# EAGLE design MicroPomodoro (EAGLE 8.6.0)
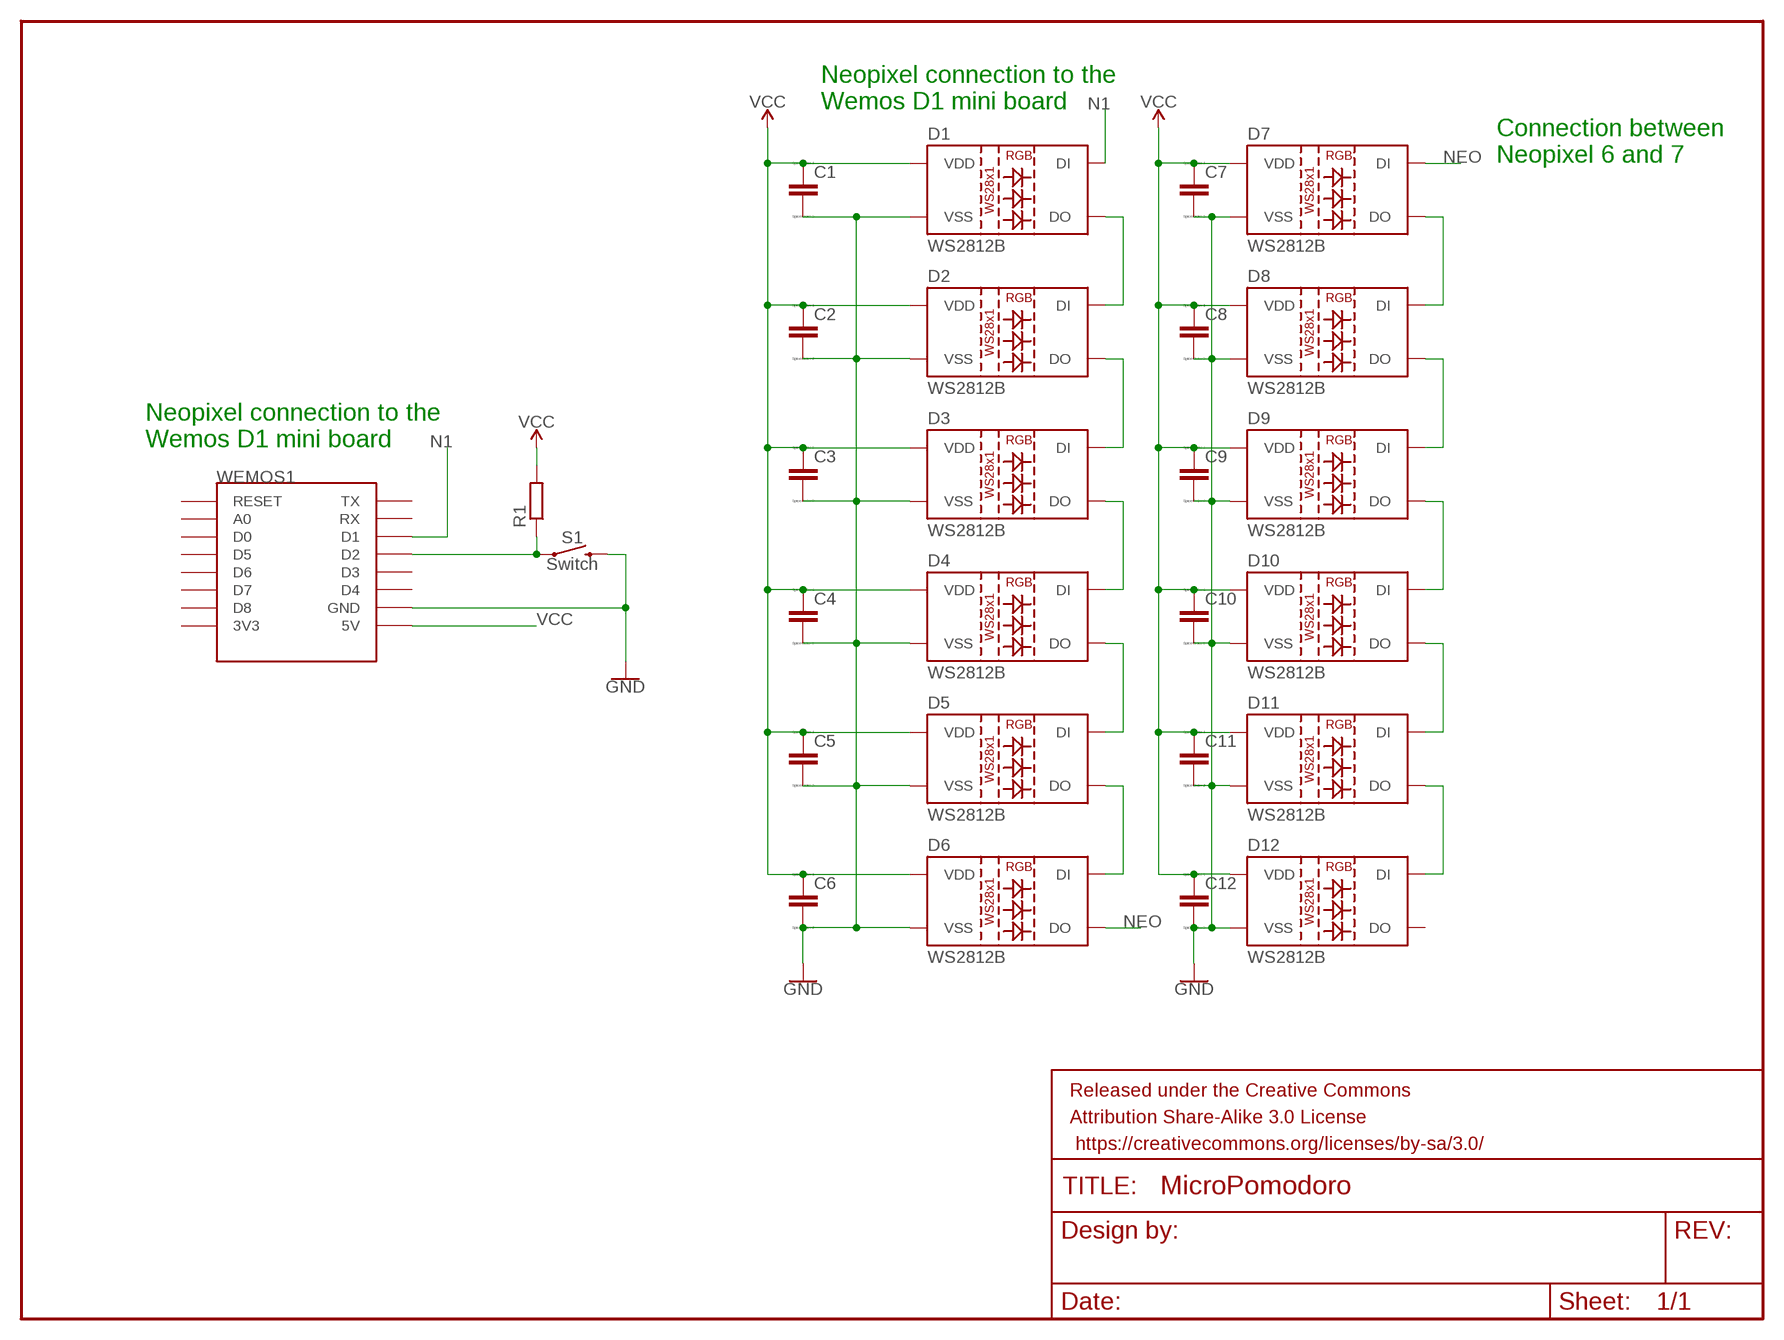
[diagram p0: schematic, sheet 1]

## Parts
C1  CC1206  [C1206]
C2  CC1206  [C1206]
C3  CC1206  [C1206]
C4  CC1206  [C1206]
C5  CC1206  [C1206]
C6  CC1206  [C1206]
C7  CC1206  [C1206]
C8  CC1206  [C1206]
C9  CC1206  [C1206]
C10  CC1206  [C1206]
C11  CC1206  [C1206]
C12  CC1206  [C1206]
D1  WS2812B  [WS2812B]
D2  WS2812B  [WS2812B]
D3  WS2812B  [WS2812B]
D4  WS2812B  [WS2812B]
D5  WS2812B  [WS2812B]
D6  WS2812B  [WS2812B]
D7  WS2812B  [WS2812B]
D8  WS2812B  [WS2812B]
D9  WS2812B  [WS2812B]
D10  WS2812B  [WS2812B]
D11  WS2812B  [WS2812B]
D12  WS2812B  [WS2812B]
FRAME1  FRAME-LETTER  [CREATIVE_COMMONS]
R1  R-EU_R1206  [R1206]
S1  Switch  MOMENTARY-SWITCH-SPST-PTH-6.0MM  [TACTILE_SWITCH_PTH_6.0MM]
WEMOS1  WEMOS-D1-MINI  [WEMOS-D1-MINI]

## Nets
GND: C1.2 C2.2 C3.2 C4.2 C5.2 C6.2 C7.2 C8.2 C9.2 C10.2 C11.2 C12.2 D1.3(VSS) D2.3(VSS) D3.3(VSS) D4.3(VSS) D5.3(VSS) D6.3(VSS) D7.3(VSS) D8.3(VSS) D9.3(VSS) D10.3(VSS) D11.3(VSS) D12.3(VSS) S1.3 WEMOS1.GND
N1: D1.4(DI) WEMOS1.D1
N$1: R1.1 S1.1 WEMOS1.D2
N$25: D1.2(DO) D2.4(DI)
N$26: D2.2(DO) D3.4(DI)
N$27: D3.2(DO) D4.4(DI)
N$28: D4.2(DO) D5.4(DI)
N$29: D5.2(DO) D6.4(DI)
N$30: D7.2(DO) D8.4(DI)
N$31: D8.2(DO) D9.4(DI)
N$32: D9.2(DO) D10.4(DI)
N$33: D10.2(DO) D11.4(DI)
N$34: D11.2(DO) D12.4(DI)
NEO: D6.2(DO) D7.4(DI)
VCC: C1.1 C2.1 C3.1 C4.1 C5.1 C6.1 C7.1 C8.1 C9.1 C10.1 C11.1 C12.1 D1.1(VDD) D2.1(VDD) D3.1(VDD) D4.1(VDD) D5.1(VDD) D6.1(VDD) D7.1(VDD) D8.1(VDD) D9.1(VDD) D10.1(VDD) D11.1(VDD) D12.1(VDD) R1.2 WEMOS1.5V
Unconnected: D12.2(DO) WEMOS1.3V3 WEMOS1.A0 WEMOS1.D0 WEMOS1.D3 WEMOS1.D4 WEMOS1.D5 WEMOS1.D6 WEMOS1.D7 WEMOS1.D8 WEMOS1.RESET WEMOS1.RX WEMOS1.TX

## Notes on the sheet
- Neopixel connection to the 
  Wemos D1 mini board
- Connection between 
  Neopixel 6 and 7
- Neopixel connection to the 
  Wemos D1 mini board

## Library data of the parts
C1-C12 = eagle-ltspice:C: CAPACITOR, European symbol; SPICEMODEL: NONE; SPICEPREFIX: C
D1-D12 = SparkFun-LED:WS2812B: WS2812B SMD addressable RGB LED 5x5mm SMD LED with built-in controller IC. Color: Red/Green/Blue mC Rating: RGB: 390, 660, 180 mcd Forward Voltage: RGB: 2.0, 3.0, 3.0 V Packages:WS2812B SparkFun Products: Blynk Board - ESP8266 <https://www.sparkfun.com/products/13794>; PROD_ID: DIO-12503
FRAME1 = SparkFun-Retired:FRAME-LETTER: Schematic Frame Standard 8.5x11 US Letter frame
R1 = resistor:R-EU_: RESISTOR, European symbol
S1 = SparkFun-Switches:MOMENTARY-SWITCH-SPST: Momentary Switch (Pushbutton) - SPST Normally-open (NO) SPST momentary switches (buttons, pushbuttons). Variants PTH-12MM - 12mm square, through-hole Momentary Pushbutton Switch - 12mm Square <https://www.sparkfun.com/products/9190> (COM-09190) PTH-6.0MM, PTH-6.0MM-KIT - 6.0mm square, through-hole Mini Pushbutton Switch <https://www.sparkfun.com/products/97> (COM-00097) KIT package intended for soldering kit's - only one side of pads' copper is exposed. PTH-RIGHT-ANGLE-KIT - Right-angle, through-hole Right Angle Tactile Button <https://www.sparkfun.com/products/10791> - Used on SparkFun BigTime Watch Kit <https://www.sparkfun.com/products/11734> SMD-12MM - 12mm square, surface-mount Tactile Button - SMD (12mm) <https://www.sparkfun.com/products/12993> (COM-12993) Used on SparkFun PicoBoard <https://www.sparkfun.com/products/11888> SMD-4.5MM - 4.5mm Square Trackball Switch Used on SparkFun Blackberry Trackballer Breakout <https://www.sparkfun.com/products/13169> SMD-4.6MMX2.8MM - 4.60mm x 2.80mm, surface mount Used on SparkFun SAMD21 Mini Breakout <https://www.sparkfun.com/products/13664> SMD-5.2MM, SMD-5.2-REDUNDANT - 5.2mm square, surface-mount Mini Pushbutton Switch - SMD <https://www.sparkfun.com/products/8720> (COM-08720) Used on Arduino Pro Mini <https://www.sparkfun.com/products/11114> REDUNDANT package connects both switch circuits together SMD-6.0X3.5MM - 6.0 x 3.5mm, surface mount Momentary Reset Switch SMD <https://www.sparkfun.com/products/8229> (COM-08229) SMD-6.2MM-TALL - 6.2mm square, surface mount Tactile Button - SMD (6mm) <https://www.sparkfun.com/products/12992> Used on SparkFun Digital Sandbox <https://www.sparkfun.com/products/12651> SMD-RIGHT-ANGLE - Right-angle, surface mount Used on SparkFun Block for Intel® Edison - Arduino <https://www.sparkfun.com/products/13036>; PROD_ID: SWCH-08441; SF_SKU: COM-00097
WEMOS1 = esp8266modules:WEMOS-D1-MINI: WeMos.cc D1 mini ESP8266 module

## Board
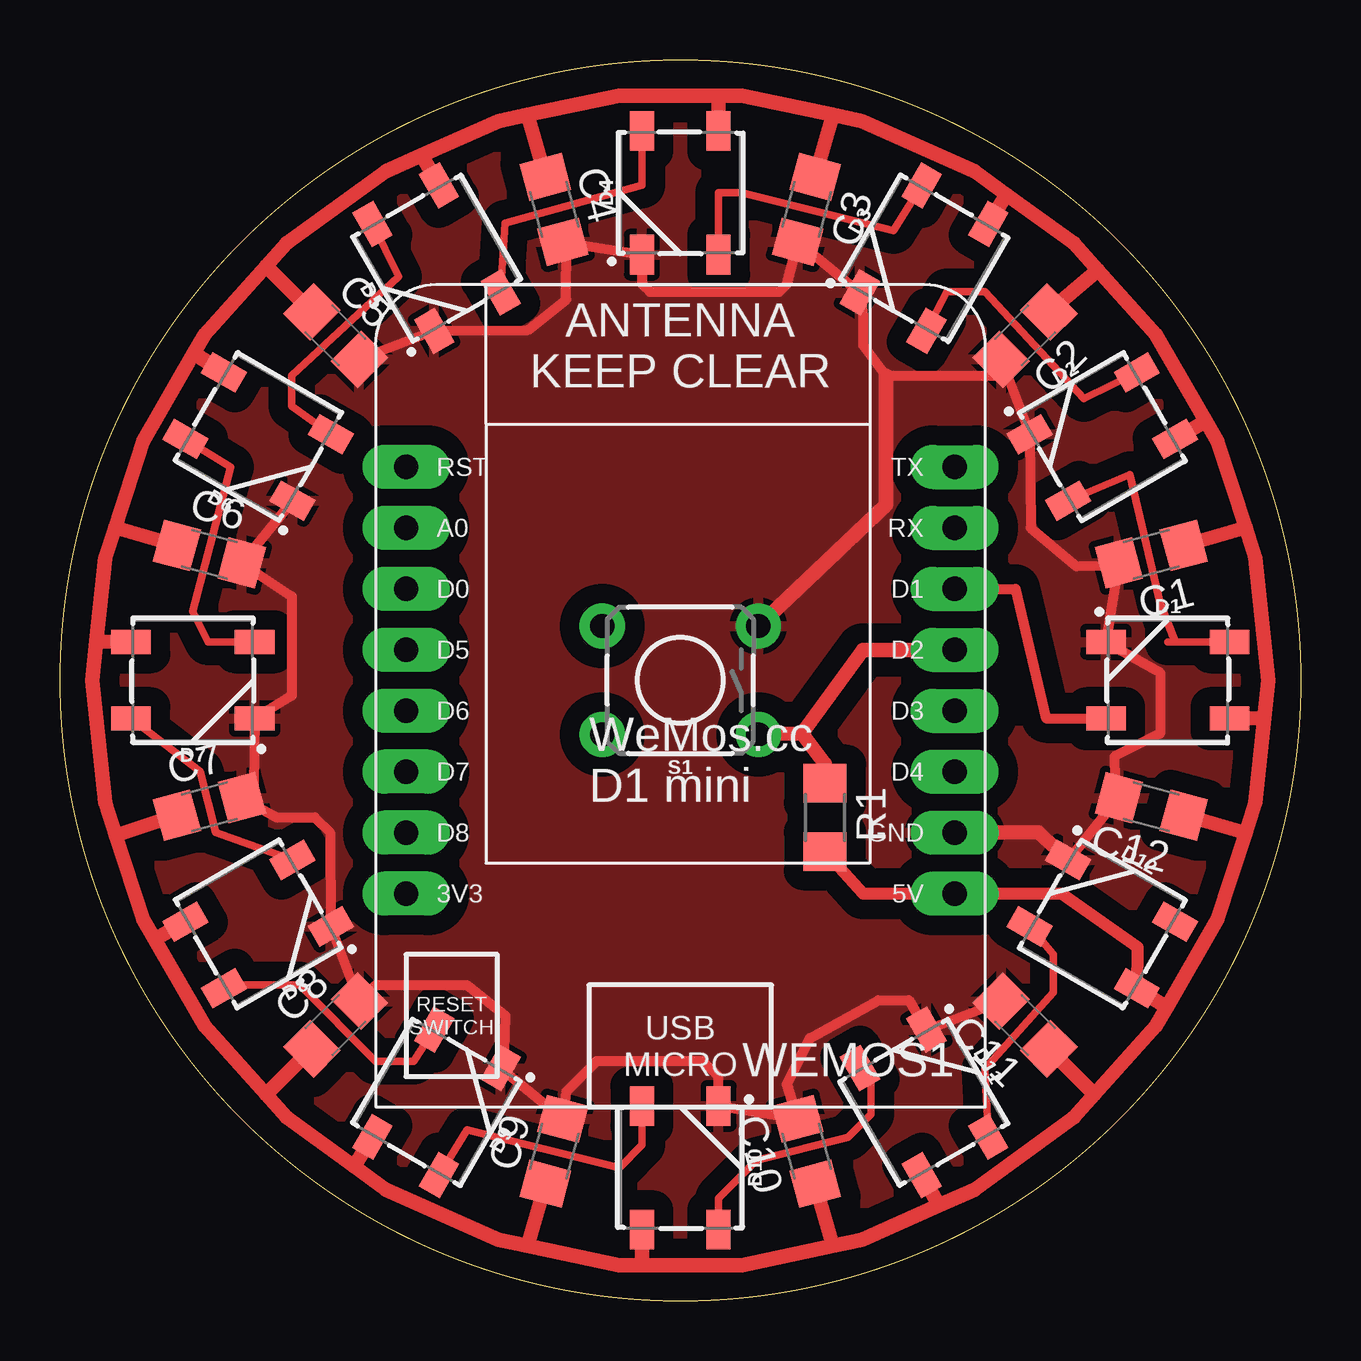
[diagram p1: board, top side]

Size 51.71 x 51.71 mm. Coordinates in mm from the lower left corner, seen from the top.
Outline: circle at 25.86,25.86 radius 25.86
Copper layers (1*16): Top 0.035mm / dielectric 1.5mm / Bottom 0.035mm
Design rules "default": minimum track width 6mil, minimum drill 0.35mm, track to track 6mil, track to pad 6mil, pad to pad 6mil, via to via 6mil, smd to smd 6mil, copper to edge 40mil, drill to drill 6mil, minimum pad ring 10mil, minimum via ring 8mil, stop-mask expansion 4mil, vias tented up to drill 0mil, thermal gap 10mil

### Footprints (pad centres in the part's own frame; a part is rotated, then mirrored left to right if it is on the bottom)
C1206 = smd 1.6 x 1.8: 1 -1.4,0; 2 1.4,0
WS2812B = smd 1.651 x 1: 1 2.577,-1.6; 2 2.577,1.6; 3 -2.577,1.6; 4 -2.577,-1.6
R1206 = smd 1.6 x 1.803: 1 -1.422,0; 2 1.422,0
TACTILE_SWITCH_PTH_6.0MM = drill 1.016 pad 1.88: 1 -3.251,2.261; 2 3.251,2.261; 3 -3.251,-2.261; 4 3.251,-2.261
WEMOS-D1-MINI = drill 1.016 pad 1.829 long: 3V3 -10.16,-10.16; 5V 12.7,-10.16; A0 -10.16,5.08; D0 -10.16,2.54; D1 12.7,2.54; D2 12.7,0; D3 12.7,-2.54; D4 12.7,-5.08; D5 -10.16,0; D6 -10.16,-2.54; D7 -10.16,-5.08; D8 -10.16,-7.62; GND 12.7,-7.62; RESET -10.16,7.62; RX 12.7,5.08; TX 12.7,7.62

### Placement (x,y rotation side)
C1  45.48,31.12 195 top
C2  40.22,40.22 225 top
C3  31.12,45.48 255 top
C4  20.6,45.48 285 top
C5  11.49,40.22 315 top
C6  6.23,31.12 345 top
C7  6.23,20.6 15 top
C8  11.49,11.49 45 top
C9  20.6,6.23 75 top
C10  31.12,6.23 105 top
C11  40.22,11.49 135 top
C12  45.48,20.6 165 top
D1  46.18,25.86 0 top
D2  43.45,36.02 30 top
D3  36.02,43.45 60 top
D4  25.86,46.18 90 top
D5  15.7,43.45 120 top
D6  8.26,36.02 150 top
D7  5.54,25.86 180 top
D8  8.26,15.7 210 top
D9  15.7,8.26 240 top
D10  25.86,5.54 270 top
D11  36.02,8.26 300 top
D12  43.45,15.7 330 top
FRAME1  18.55,-10.66 0 top  (outside the outline)
R1  31.89,20.14 270 top
S1  25.86,25.86 180 top
WEMOS1  24.59,27.13 0 top

### Tracks (layer width: path | path; a pad name or v marks a point on that pad's centre or on a via)
GND
  Top 0.406: D9.3 18.49,9.59 | 18.49,9.59 C9.2 21.09,8.71 22.36,9.98 26.81,9.98 27.44,9.35 D10.3 C10.2 30.3,9.03 31.25,10.93 34.11,12.52 35.38,12.52 D11.3 C11.2 | C4.2 21.12,44.11 | 21.12,44.11 D4.3 24.27,42.37 24.59,42.05 29.98,42.05 30.3,42.37 C3.2 D3.3 33.48,41.1 33.48,39.83 34.43,38.56 39.5,38.55 | C2.2 39.5,38.55 | 39.5,38.55 D2.3 40.46,32.21 42.37,30.62 44.11,30.64 | C1.2 44.11,30.64 | 44.11,30.64 D1.3 45.86,26.17 45.86,23.63 43.95,22.68 44,20.8 | C12.2 44,20.8 | 44,20.8 D12.3 | C5.2 D5.3 19.51,40.46 21.09,41.73 21.12,44.11 | D6.3 C6.2 9.66,29.35 9.66,25.22 D7.3 8.08,21.41 C7.2 9.03,20.14 10.62,20.14 11.25,19.51 D8.3 C8.2 13.16,13.16 16.97,13.16 18.55,11.89 18.49,9.59
  Top 0.61: WEMOS1.GND 40.78,19.51 D12.3 | S1.3 34.43,33.16 34.43,38.56
  pour Top (isolate 0.813): -2.08,57.92 -2.4,-2.72 54.11,-2.72 54.11,57.92
N1
  Top 0.406: WEMOS1.D1 39.83,29.67 41.1,24.27 D1.4
N$1
  Top 0.61: 30.94,23.63 31.89,22.36 R1.1 | S1.1 30.94,23.63 | WEMOS1.D2 33.48,27.13 30.94,23.63
N$25
  Top 0.305: D1.2 46.49,27.45 | 46.49,27.45 46.18,27.44 | D2.4 44.59,34.43 45.86,29.03 46.49,27.45
N$26
  Top 0.305: D2.2 42.68,37.6 38.56,42.05 36.97,42.05 D3.4
N$27
  Top 0.305: D3.2 34.75,44.59 28.4,46.18 27.44,46.18 D4.4
N$28
  Top 0.305: D5.4 18.55,44.91 24.27,46.49 D4.2
N$29
  Top 0.305: D5.2 14.11,42.68 9.66,38.56 9.66,37.29 D6.4
N$30
  Top 0.305: D8.4 6.49,19.51 5.85,22.05 D7.2
N$31
  Top 0.305: D9.4 14.74,9.98 13.16,9.98 9.98,13.16 7.44,13.16 D8.2
N$32
  Top 0.305: D9.2 16.97,7.12 23.32,5.54 24.27,6.49 D10.4
N$33
  Top 0.305: D10.2 27.44,4.27 29.03,5.85 32.84,6.81 33.79,7.76 33.79,9.03 D11.4
N$34
  Top 0.305: D11.2 38.56,9.66 41.41,12.84 41.41,14.43 D12.4
NEO
  Top 0.305: D6.2 7.12,34.75 5.54,28.71 6.17,27.44 D7.4
VCC
  Top 0.508: D12.1 44.91,14.74 41.73,16.97 WEMOS1.5V 33.48,16.97 R1.2
  Top 0.61: 49.42,32.23 49.83,30.95 50.37,25.86 50.2,24.28 | 49.42,32.23 48.25,35.83 47.77,36.65 | 47.77,36.65 45.69,40.26 43.26,42.95 | 43.26,42.95 42.26,44.07 39.46,46.11 | 39.46,46.11 38.11,47.08 33.43,49.17 32.22,49.42 | 32.22,49.42 28.42,50.23 27.44,50.23 | 27.44,50.23 23.29,50.23 19.49,49.42 | 19.49,49.42 18.28,49.17 15.07,47.74 | 15.07,47.74 13.6,47.08 9.46,44.07 8.59,43.11 | 8.59,43.11 6.03,40.26 5.58,39.49 | 5.58,39.49 3.46,35.83 2.3,32.23 | 2.3,32.23 1.88,30.95 1.51,27.47 | 1.51,27.47 1.35,25.86 1.88,20.76 2.33,19.39 | 2.33,19.39 3.46,15.89 3.94,15.06 | 3.94,15.06 6.03,11.45 8.59,8.6 | 8.59,8.6 9.46,7.64 12.26,5.61 | 12.26,5.61 13.6,4.63 18.28,2.55 19.49,2.29 | 19.49,2.29 23.29,1.48 24.27,1.48 | 24.27,1.48 28.42,1.48 32.22,2.29 | 32.22,2.29 33.43,2.55 36.64,3.97 | 36.64,3.97 38.11,4.63 42.26,7.64 43.12,8.6 | 43.12,8.6 45.69,11.45 46.14,12.23 | 46.14,12.23 48.25,15.89 49.42,19.49 | 49.42,19.49 49.83,20.76 50.2,24.28 | C4.1 19.49,49.42 | D4.1 27.44,50.23 | D5.1 15.07,47.74 | C5.1 8.59,43.11 | D6.1 5.58,39.49 | C6.1 2.3,32.23 | D7.1 1.51,27.47 | C7.1 2.33,19.39 | D8.1 3.94,15.06 | C8.1 8.59,8.6 | D9.1 12.26,5.61 | C9.1 19.49,2.29 | D10.1 24.27,1.48 | C10.1 32.22,2.29 | D11.1 36.64,3.97 | C11.1 43.12,8.6 | D12.1 46.14,12.23 | C12.1 49.42,19.49 | D1.1 50.2,24.28 | C1.1 49.42,32.23 | D2.1 47.77,36.65 | C2.1 43.26,42.95 | D3.1 39.46,46.11 | C3.1 32.22,49.42